# EAGLE design LTC4040_to_Breadboard (EAGLE 9.3.1)
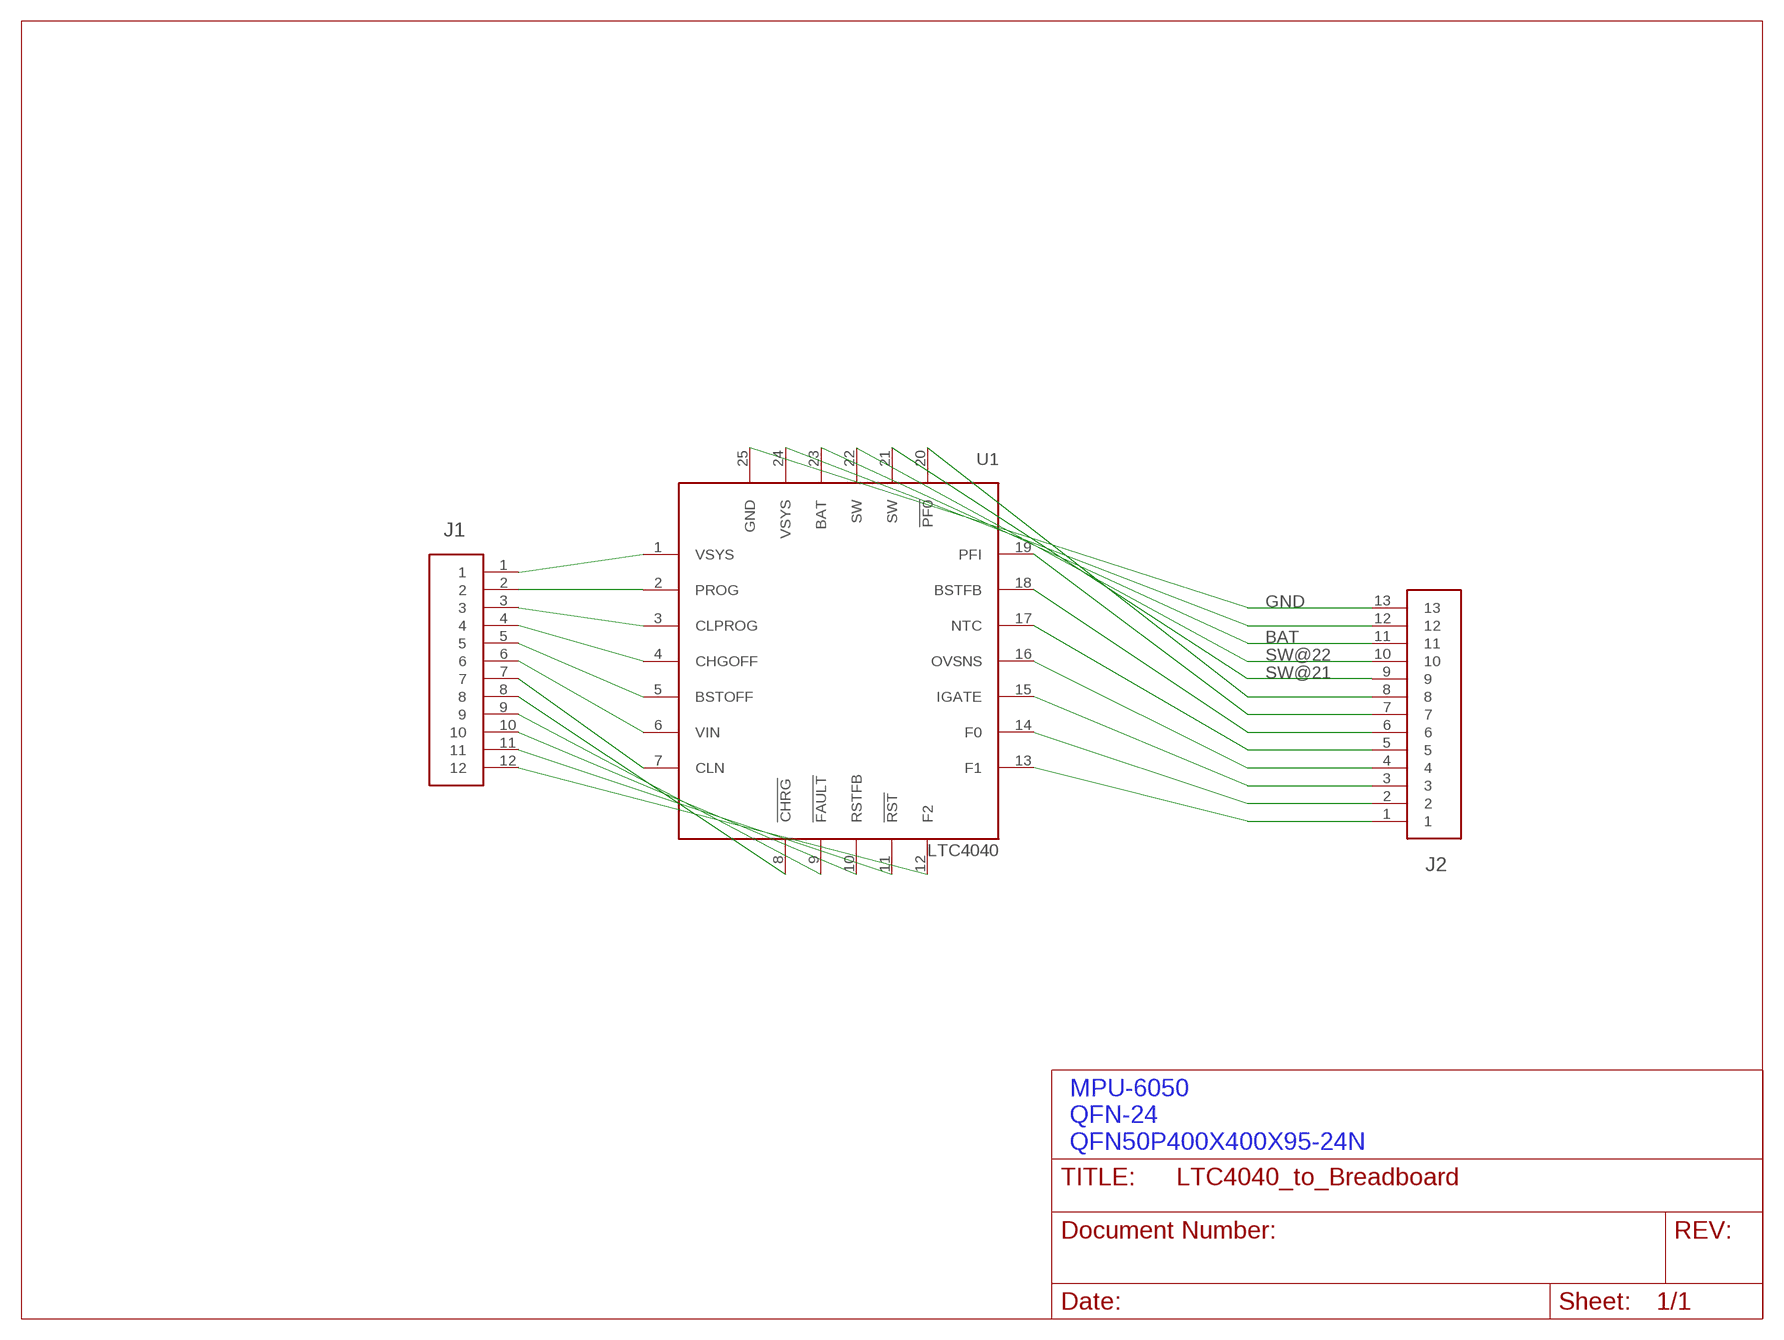
[diagram p0: schematic, sheet 1]

## Parts
J1  CONNECTOR_12  [68000-112HLF]
J2  CONNECTOR_13  [68000-113HLF_NO_SQUARE]
U1  LTC4040  [QFN50P500X400X80-25N]

## Nets
BAT [power]: J2.11 U1.23(BAT)
GND [power]: J2.13 U1.25(GND)
N$1: J1.1 U1.1(VSYS)
N$2: J1.2 U1.2(PROG)
N$3: J1.3 U1.3(CLPROG)
N$4: J1.4 U1.4(CHGOFF)
N$5: J1.5 U1.5(BSTOFF)
N$6: J1.6 U1.6(VIN)
N$7: J1.7 U1.7(CLN)
N$8: J1.8 U1.8(!CHRG)
N$9: J1.9 U1.9(!FAULT)
N$10: J1.10 U1.10(RSTFB)
N$11: J1.11 U1.11(!RST)
N$12: J1.12 U1.12(F2)
N$13: J2.1 U1.13(F1)
N$14: J2.2 U1.14(F0)
N$15: J2.3 U1.15(IGATE)
N$16: J2.4 U1.16(OVSNS)
N$17: J2.5 U1.17(NTC)
N$18: J2.6 U1.18(BSTFB)
N$19: J2.7 U1.19(PFI)
N$20: J2.8 U1.20(!PF0)
N$24: J2.12 U1.24(VSYS)
SW@21 [power]: J2.9 U1.21(SW)
SW@22 [power]: J2.10 U1.22(SW)

## Notes on the sheet
- MPU-6050
  QFN-24 
  QFN50P400X400X95-24N

## Library data of the parts
J1 = SnapEDA:CONNECTOR_12
J2 = SnapEDA:CONNECTOR_13
U1 = SnapEDA:LTC4040

## Net classes
1 power: width 0.279 mm, drill 0.762 mm

## Board
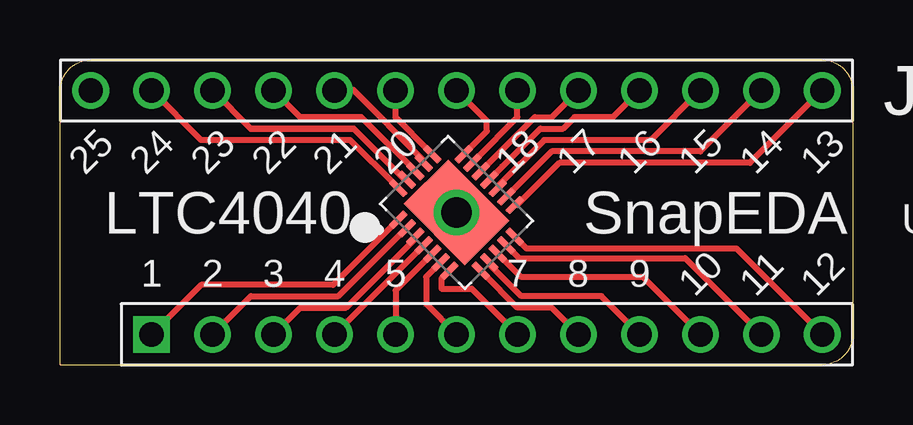
[diagram p1: board, top side]
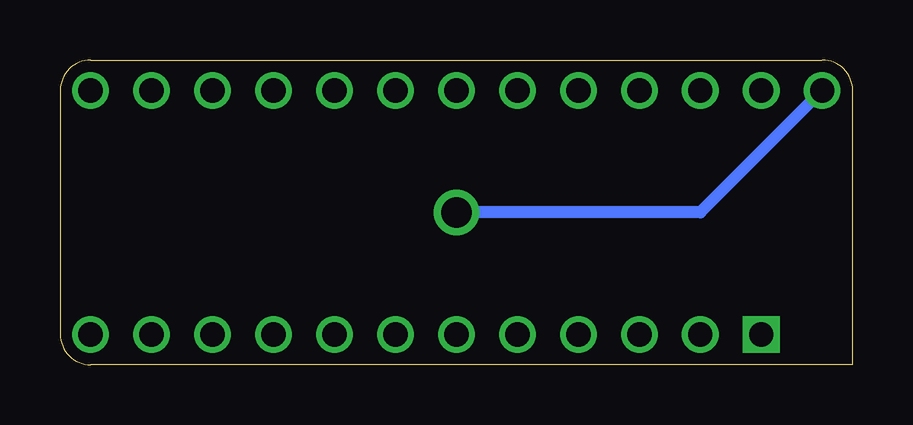
[diagram p2: board, bottom side, seen from below]

Size 33.04 x 12.7 mm. Coordinates in mm from the lower left corner, seen from the top.
Outline: 1.3,12.7 31.76,12.7 arc-90 33.03,11.43 arc0 33.03,1.27 arc-90 31.76,0 0.01,0 arc0 0.01,11.43 arc-90 1.28,12.7
Copper layers (1*16): Top 0.035559375mm / dielectric 1.6mm / Bottom 0.035559375mm
Design rules "oshpark-2layer *": minimum track width 10mil, minimum drill 10mil, track to track 6mil, track to pad 6mil, pad to pad 6mil, via to via 6mil, smd to smd 6mil, copper to edge 15mil, drill to drill 6mil, minimum pad ring 5mil, minimum via ring 5mil, stop-mask expansion 2.5mil, vias tented up to drill 0mil, thermal gap 10mil

### Footprints (pad centres in the part's own frame; a part is rotated, then mirrored left to right if it is on the bottom)
68000-112HLF = drill 1.016 square: 1 -13.97,0 | drill 1.016: 2 -11.43,0; 3 -8.89,0; 4 -6.35,0; 5 -3.81,0; 6 -1.27,0; 7 1.27,0; 8 3.81,0; 9 6.35,0; 10 8.89,0; 11 11.43,0; 12 13.97,0
68000-113HLF_NO_SQUARE = drill 1.016: 1 -15.24,0; 2 -12.7,0; 3 -10.16,0; 4 -7.62,0; 5 -5.08,0; 6 -2.54,0; 7 0,0; 8 2.54,0; 9 5.08,0; 10 7.62,0; 11 10.16,0; 12 12.7,0; 13 15.24,0
QFN50P500X400X80-25N = smd 0.86 x 0.27: 1 -1.935,1.5; 2 -1.935,1; 3 -1.935,0.5; 4 -1.935,0; 5 -1.935,-0.5; 6 -1.935,-1; 7 -1.935,-1.5; 13 1.935,-1.5; 14 1.935,-1; 15 1.935,-0.5; 16 1.935,0; 17 1.935,0.5; 18 1.935,1; 19 1.935,1.5 | smd 0.27 x 0.86: 8 -1,-2.435; 9 -0.5,-2.435; 10 0,-2.435; 11 0.5,-2.435; 12 1,-2.435; 20 1,2.435; 21 0.5,2.435; 22 0,2.435; 23 -0.5,2.435; 24 -1,2.435 | smd 2.61 x 3.61: 25 0,0

### Placement (x,y rotation side)
J1  17.79,1.27 0 top
J2  16.52,11.43 180 top
U1  16.52,6.35 45 top

### Tracks (layer width: path | path; a pad name or v marks a point on that pad's centre or on a via)
BAT
  Top 0.279: J2.11 7.95,9.84 12.23,9.84 14.3,7.78 U1.23
GND  (via drill 1.27)
  Top 0.508: U1.25 17.16,6.35
  Bottom 0.508: J2.13 6.36,6.35 U1.25
  other vias: 16.52,6.35
N$1
  Top 0.254: J1.1 5.88,3.33 11.38,3.33 U1.1
N$2
  Top 0.254: J1.2 7.95,2.86 11.6,2.86 14.3,5.56 U1.2
N$3
  Top 0.254: J1.3 10.01,2.38 11.92,2.38 14.77,5.24 U1.3
N$4
  Top 0.254: J1.4 U1.4
N$5
  Top 0.254: U1.5 13.98,3.1 J1.5
N$6
  Top 0.254: 15.73,4.13 U1.6 15.25,3.67 15.25,2.54 J1.6
N$7
  Top 0.254: U1.7 15.89,3.59 15.89,3.17 17.16,3.17 J1.7
N$8
  Top 0.254: J1.8 20.49,2.38 19.06,2.38 17.63,3.81 U1.8
N$9
  Top 0.254: J1.9 22.55,2.86 19.22,2.86 17.95,4.13 U1.9
N$10
  Top 0.254: J1.10 24.3,3.65 19.22,3.65 18.27,4.6 U1.10
N$11
  Top 0.254: U1.11 19.13,4.45 26.05,4.45 J1.11
N$12
  Top 0.254: 19.06,5.24 U1.12 19.43,4.85 28.18,4.85 J1.12
N$13
  Top 0.254: J2.1 28.74,8.41 20.81,8.41 19.06,6.67 U1.13
N$14
  Top 0.254: J2.2 26.68,8.89 20.49,8.89 18.74,7.14 U1.14
N$15
  Top 0.254: J2.3 24.62,9.37 20.17,9.37 18.27,7.46 U1.15
N$16
  Top 0.254: U1.16 18.43,8.26 18.58,8.41 20.01,9.84 20.97,9.84 21.44,10.32 23.03,10.32 J2.4
N$17
  Top 0.254: J2.5 20.49,10.32 19.78,10.32 U1.17
N$18
  Top 0.254: U1.18 17.31,8.57 19.06,10.32 J2.6
N$19
  Top 0.254: 16.84,11.43 J2.7 17.79,10.16 17.79,9.74 U1.19
N$20
  Top 0.254: J2.8 13.98,10.3 15.38,8.91 15.41,8.89 15.43,8.86 U1.20
N$24
  Top 0.254: J2.12 5.88,9.37 12.09,9.37 13.96,7.49 13.98,7.46 14.01,7.44 U1.24
SW@21
  Top 0.279: J2.9 12.23,11.43 15.09,8.57 U1.21
SW@22
  Top 0.279: J2.10 10.01,10.32 12.55,10.32 14.77,8.1 U1.22

### Text on the board
tPlace: 25 | 24 | 23 | 22 | 21 | 20 | 18 | 17 | 16 | 15 | 14 | 13 | LTC4040 | SnapEDA | 1 | 2 | 3 | 4 | 5 | 7 | 8 | 9 | 10 | 11 | 12